# EasyEDA schematic AltitudeHeadingReminder.json
TITLE: Altitude Heading Reminder; REV: 1.0; Date: 2020-07-20; Sheet: 1/1; Drawn By: Trevor Bartlett; Company: Michael Scott Paper Company
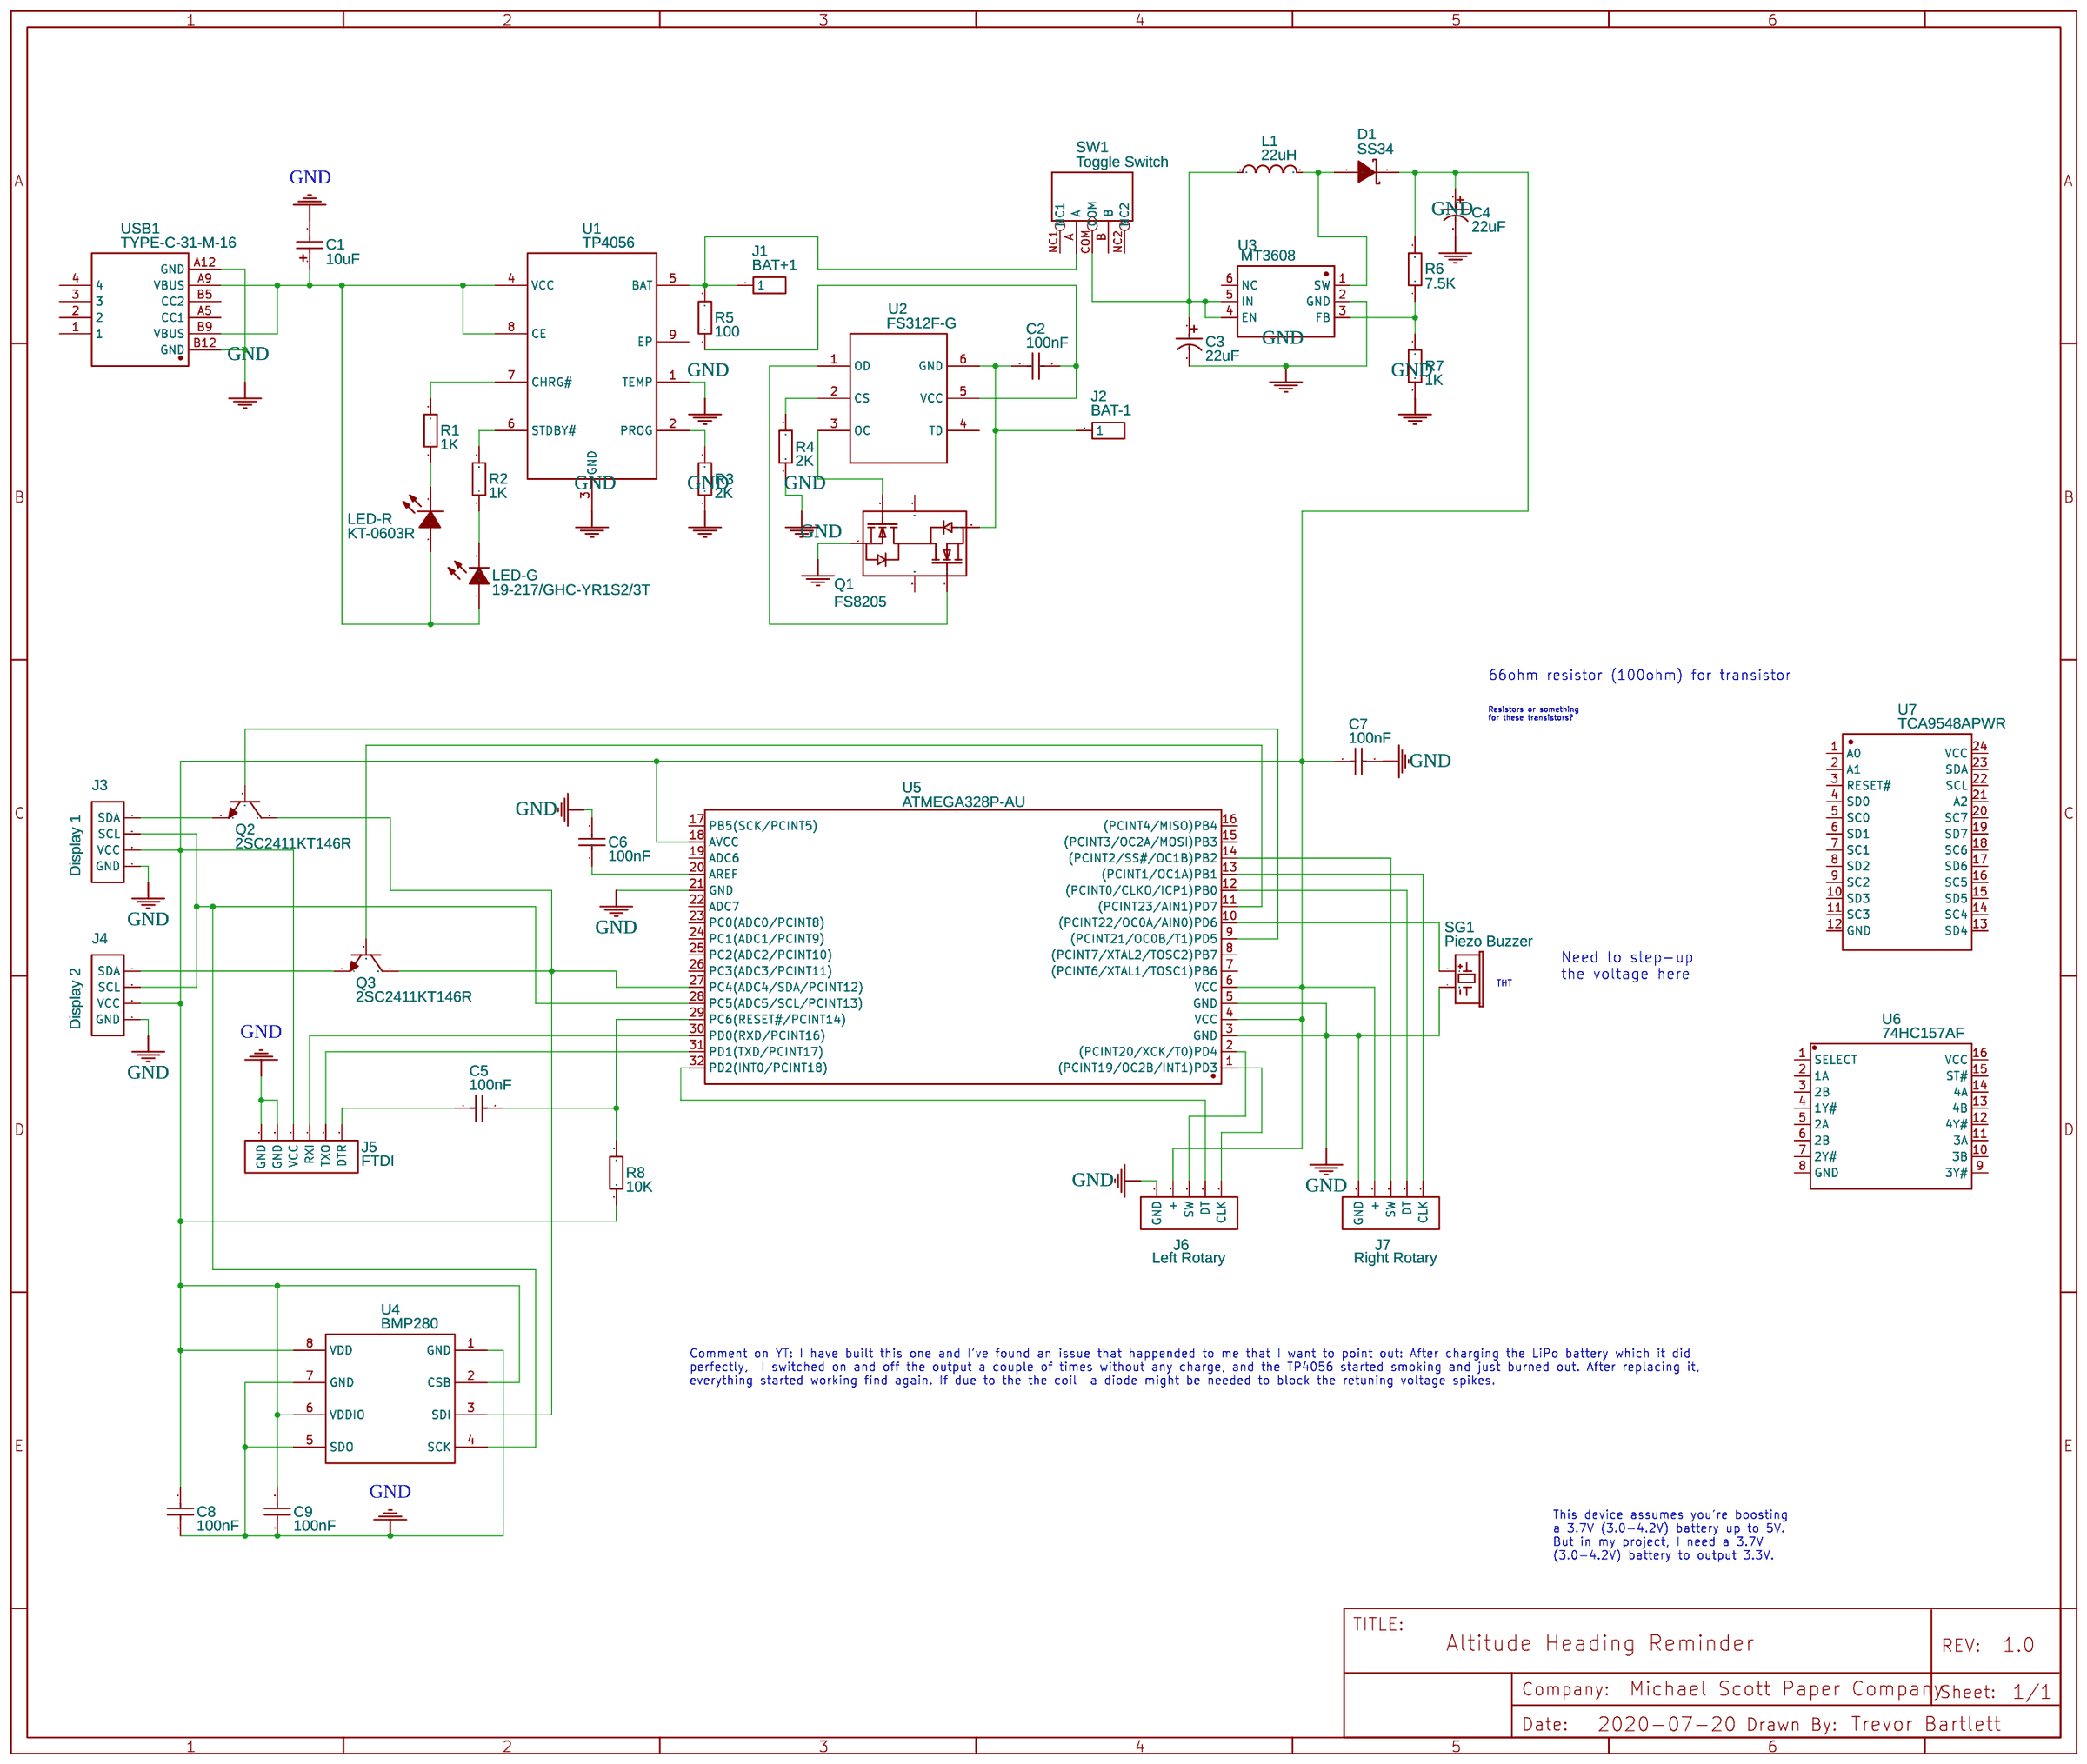
[diagram p0: schematic sheet]

## Parts
C1  10uF  [CAP-SMD_L3.2-W1.6-R-RD]
C2  100nF  [C0402]
C3  22uF  [CAP-SMD_L3.2-W1.6-R-RD]
C4  22uF  [CAP-SMD_L3.2-W1.6-R-RD]
C5  100nF  [C0402]
C6  100nF  [C0402]
C7  100nF  [C0402]
C8  100nF  [C0402]
C9  100nF  [C0402]
D1  SS34  [SMA(DO-214AC)]
J1  BAT+1  [HDR-M-2.54_1X1]
J2  BAT-1  [HDR-M-2.54_1X1]
J3  Display 1  [HDR-M-2.54_1X4]
J4  Display 2  [HDR-M-2.54_1X4]
J5  FTDI  [HDR-M-2.54_1X6]
J6  Left Rotary  [HDR-M-2.54_1X5]
J7  Right Rotary  [HDR-M-2.54_1X5]
L1  22uH  [L0805]
LED-G  19-217/GHC-YR1S2/3T  [LED0603-R-RD]
LED-R  KT-0603R  [LED0603-R-RD]
Q1  FS8205  [SOT-23-6]
Q2  2SC2411KT146R  [SOT-346_L2.9-W1.6-P1.90-LS2.8-TR-CW]
Q3  2SC2411KT146R  [SOT-346_L2.9-W1.6-P1.90-LS2.8-TR-CW]
R1  1K  [R0402]
R2  1K  [R0402]
R3  2K  [R0402]
R4  2K  [R0402]
R5  100  [R1206]
R6  7.5K  [R2010]
R7  1K  [R0402]
R8  10K  [R1206]
SG1  Piezo Buzzer  [BUZZER-12MM]
SW1  Toggle Switch  [SW5-2.0-8.8X4.4X4.7MM-90D]
U1  TP4056  [ESOP-8_L4.9-W3.9-P1.27-LS6.0-BL-EP]
U2  FS312F-G  [SOT-23-6]
U3  MT3608  [SOT-23-6]
U4  BMP280  [SENSOR-TH_BMP280-BL]
U5  ATMEGA328P-AU  [TQFP-32_L7.0-W7.0-P0.80-LS9.0-BL]
U6  74HC157AF  [SOIC-16_L10.8-W5.5-P1.27-LS7.8-BL]
U7  TCA9548APWR  [TSSOP-24_L7.8-W4.4-P0.65-LS6.4-BL]
USB1  TYPE-C-31-M-16  [TYPE-C-SMD_TYPE-C-31-M-16]

## Library data of the parts
C1 = TAJA106K016RNJ: Supplier: LCSC; Manufacturer: AVX; LCSC Assembly: Yes; Supplier Part: C7171; SMT Type: Basic
C2 C5-C9 = CL05B104KO5NNNC: Supplier: LCSC; Manufacturer: SAMSUNG; LCSC Assembly: Yes; Supplier Part: C1525; SMT Type: Basic
C3 C4 = CA45-A-6.3V-22uF-M: Supplier: LCSC; Manufacturer: CEC; Contributor: LCSC; Supplier Part: C140378; LCSC Assembly: Yes; SMT Type: Extend
D1 = -: Supplier: LCSC; Supplier Part: C8678
J1 J2 = HDR-M-2.54_1x1: Supplier Part: C81276; Supplier: LCSC; Contributor: LCEDA_Lib
J3 J4 = HDR-M-2.54_1x4: Supplier Part: C124378; Supplier: LCSC; Contributor: LCEDA_Lib
J5 = HDR-M-2.54_1x6: Supplier Part: C190819; Supplier: LCSC; Contributor: LCEDA_Lib
J6 J7 = HDR-M-2.54_1x5: Supplier Part: C358687; Supplier: LCSC; Contributor: LCEDA_Lib
L1 = SDFL2012T220KTF: Supplier: LCSC; Manufacturer: Sunlord; LCSC Assembly: Yes; Supplier Part: C32375; SMT Type: Basic
LED-G = 19-217/GHC-YR1S2/3T: Supplier: LCSC; Manufacturer: EVERLIGHT; LCSC Assembly: Yes; image: //image.lceda.cn/szlcsc/C72043.jpg; Supplier Part: C72043; SMT Type: Basic
LED-R = KT-0603R: Supplier: LCSC; Manufacturer: KENTO; LCSC Assembly: Yes; image: //image.lceda.cn/szlcsc/C2286.jpg; Supplier Part: C2286; SMT Type: Basic
Q1 = -: Supplier: LCSC; Manufacturer: FORTUNE; Supplier Part: C32254
Q2 Q3 = 2SC2411KT146R: Supplier: LCSC; Supplier Part: C122622; Manufacturer: ROHM Semicon; Contributor: LCSC; LCSC Assembly: Yes; SMT Type: Extend
R1 R2 R7 = 0402WGF1001TCE: Supplier: LCSC; Manufacturer: UniOhm; LCSC Assembly: Yes; Supplier Part: C11702; SMT Type: Basic
R3 R4 = 0402WGF2001TCE: Supplier: LCSC; Manufacturer: UniOhm; LCSC Assembly: Yes; Supplier Part: C4109; SMT Type: Basic
R5 = 1206W4F1000T5E: Supplier: LCSC; Manufacturer: UniOhm; LCSC Assembly: Yes; Supplier Part: C17901; SMT Type: Basic
R6 = AECR2010F7K50K9: Supplier: LCSC; Supplier Part: C351751; Manufacturer: ResistorToday; Contributor: LCSC
R8 = 1206W4F1002T5E: Supplier: LCSC; Manufacturer: UniOhm; LCSC Assembly: Yes; Supplier Part: C17902; SMT Type: Basic
SG1 = Piezo Buzzer: Contributor: SparkFun; sourceId: 0s1nhpZJj
SW1 = -: DIP Toggle Switch ON-ON; 0.3A- AC 500V; catid: 20; Manufacturer Part: 3P-2.0-90D-REINFORCE;
U1 = TP4056: Contributor: Guest; Supplier: LCSC; Manufacturer: TOPPOWER; LCSC Assembly: Yes; image: //image.lceda.cn/szlcsc/C16581.jpg; Supplier Part: C16581; SMT Type: Basic
U2 = -: Supplier: LCSC; Manufacturer: FORTUNE; Manufacturer Part: DW01+G; Supplier Part: C14213
U3 = -: Supplier: LCSC; Manufacturer: LCSC; Supplier Part: C84817
U4 = BMP280: Supplier: LCSC; Manufacturer: Bosch; Supplier Part: C83291; LCSC Assembly: Yes; SMT Type: Extend
U5 = ATMEGA328P-AU: Supplier: LCSC; Manufacturer: MICROCHIP; image: //image.lceda.cn/szlcsc/C14877.jpg; Supplier Part: C14877; LCSC Assembly: Yes; SMT Type: Extend
U6 = 74HC157AF: Supplier: LCSC; Manufacturer: TOSHIBA; Supplier Part: C8166; LCSC Assembly: Yes; SMT Type: Extend
U7 = TCA9548APWR: Supplier: LCSC; Manufacturer: TI; Supplier Part: C130026; LCSC Assembly: Yes; SMT Type: Extend
USB1 = TYPE-C-31-M-16: Supplier: LCSC; Supplier Part: C283541; Manufacturer: Korean Hroparts Elec; Contributor: LCSC

## Nets
GND: C1.2 C3.2 C4.2 C6.1 C7.2 C8.1 C9.1 J3.1(GND) J4.1(GND) J5.5(GND) J5.6(GND) J6.5(GND) J7.5(GND) Q1.1(S1) R3.1 R4.1 R7.1 SG1.-(2) U1.1(TEMP) U1.3(GND) U3.2(GND) U4.1(GND) U4.5(SDO) U4.7(GND) U5.3(GND) U5.5(GND) U5.21(GND) USB1.A12(GND) USB1.B12(GND)
Net-(C1-1): C1.1 LED-G.1(A) LED-R.1(A) U1.4(VCC) U1.8(CE) USB1.A9(VBUS) USB1.B9(VBUS)
Net-(C2-1): C2.1 R5.1 U2.5(VCC)
Net-(C2-2): C2.2 J2.1 Q1.3(S2) U2.6(GND)
Net-(C3-1): C3.1 L1.1 SW1.COM U3.4(EN) U3.5(IN)
Net-(C4-1): C4.1 C7.1 C8.2 C9.2 D1.2(K) J3.2(VCC) J4.2(VCC) J5.4(VCC) J6.4(+) J7.4(+) R6.2 R8.1 U4.2(CSB) U4.6(VDDIO) U4.8(VDD) U5.4(VCC) U5.6(VCC) U5.18(AVCC)
Net-(C5-1): C5.1 R8.2 U5.29(PC6(RESET#/PCINT14))
Net-(C5-2): C5.2 J5.1(DTR)
Net-(C6-2): C6.2 U5.20(AREF)
Net-(D1-1): D1.1(A) L1.2 U3.1(SW)
Net-(J1-1): J1.1 R5.2 SW1.A U1.5(BAT)
Net-(J3-3): J3.3(SCL) J4.3(SCL) U4.4(SCK) U5.28(PC5(ADC5/SCL/PCINT13))
Net-(J3-4): J3.4(SDA) Q2.1(E)
Net-(J4-4): J4.4(SDA) Q3.1(E)
Net-(J5-2): J5.2(TXO) U5.31(PD1(TXD/PCINT17))
Net-(J5-3): J5.3(RXI) U5.30(PD0(RXD/PCINT16))
Net-(J6-1): J6.1(CLK) U5.1((PCINT19/OC2B/INT1)PD3)
Net-(J6-2): J6.2(DT) U5.32(PD2(INT0/PCINT18))
Net-(J6-3): J6.3(SW) U5.2((PCINT20/XCK/T0)PD4)
Net-(J7-1): J7.1(CLK) U5.13((PCINT1/OC1A)PB1)
Net-(J7-2): J7.2(DT) U5.12((PCINT0/CLKO/ICP1)PB0)
Net-(J7-3): J7.3(SW) U5.14((PCINT2/SS#/OC1B)PB2)
Net-(LED-G-2): LED-G.2(C) R2.1
Net-(LED-R-2): LED-R.2(K) R1.1
Net-(Q1-4): Q1.4(G2) U2.1(OD)
Net-(Q1-6): Q1.6(G1) U2.3(OC)
Net-(Q2-2): Q2.2(B) U5.9((PCINT21/OC0B/T1)PD5)
Net-(Q2-3): Q2.3(C) Q3.3(C) U4.3(SDI) U5.27(PC4(ADC4/SDA/PCINT12))
Net-(Q3-2): Q3.2(B) U5.11((PCINT23/AIN1)PD7)
Net-(R1-2): R1.2 U1.7(CHRG#)
Net-(R2-2): R2.2 U1.6(STDBY#)
Net-(R3-2): R3.2 U1.2(PROG)
Net-(R4-2): R4.2 U2.2(CS)
Net-(R6-1): R6.1 R7.2 U3.3(FB)
Net-(SG1-+): SG1.+(1) U5.10((PCINT22/OC0A/AIN0)PD6)

Not connected (* = marked no-connect by the designer): Q1 2(D12) 5(D12); SW1 B NC1 NC2; U1 9(EP); U2 4(TD); U3 6(NC); U5 7((PCINT6/XTAL1/TOSC1)PB6) 8((PCINT7/XTAL2/TOSC2)PB7) 15((PCINT3/OC2A/MOSI)PB3) 16((PCINT4/MISO)PB4) 17(PB5(SCK/PCINT5)) 19(ADC6) 22(ADC7) 23(PC0(ADC0/PCINT8)) 24(PC1(ADC1/PCINT9)) 25(PC2(ADC2/PCINT10)) 26(PC3(ADC3/PCINT11)); U6 1(SELECT) 2(1A) 3(2B) 4(1Y#) 5(2A) 6(2B) 7(2Y#) 8(GND) 9(3Y#) 10(3B) 11(3A) 12(4Y#) 13(4B) 14(4A) 15(ST#) 16(VCC); U7 1(A0) 2(A1) 3(RESET#) 4(SD0) 5(SC0) 6(SD1) 7(SC1) 8(SD2) 9(SC2) 10(SD3) 11(SC3) 12(GND) 13(SD4) 14(SC4) 15(SD5) 16(SC5) 17(SD6) 18(SC6) 19(SD7) 20(SC7) 21(A2) 22(SCL) 23(SDA) 24(VCC); USB1 1 2 3 4 A5(CC1) B5(CC2)

## Notes on the sheet
- 66ohm resistor (100ohm) for transistor
- Resistors or something
  for these transistors?
- Need to step-up
  the voltage here
- THT
- Comment on YT: I have built this one and I've found an issue that happended to me that I want to point out: After charging the LiPo battery which it did
  perfectly,  I switched on and off the output a couple of times without any charge, and the TP4056 started smoking and just burned out. After replacing it,
  everything started working find again. If due to the the coil  a diode might be needed to block the retuning voltage spikes.
- This device assumes you're boosting
  a 3.7V (3.0-4.2V) battery up to 5V.
  But in my project, I need a 3.7V
  (3.0-4.2V) battery to output 3.3V.
